# EAGLE design CPB_IEEE_out (EAGLE 9.6.2)
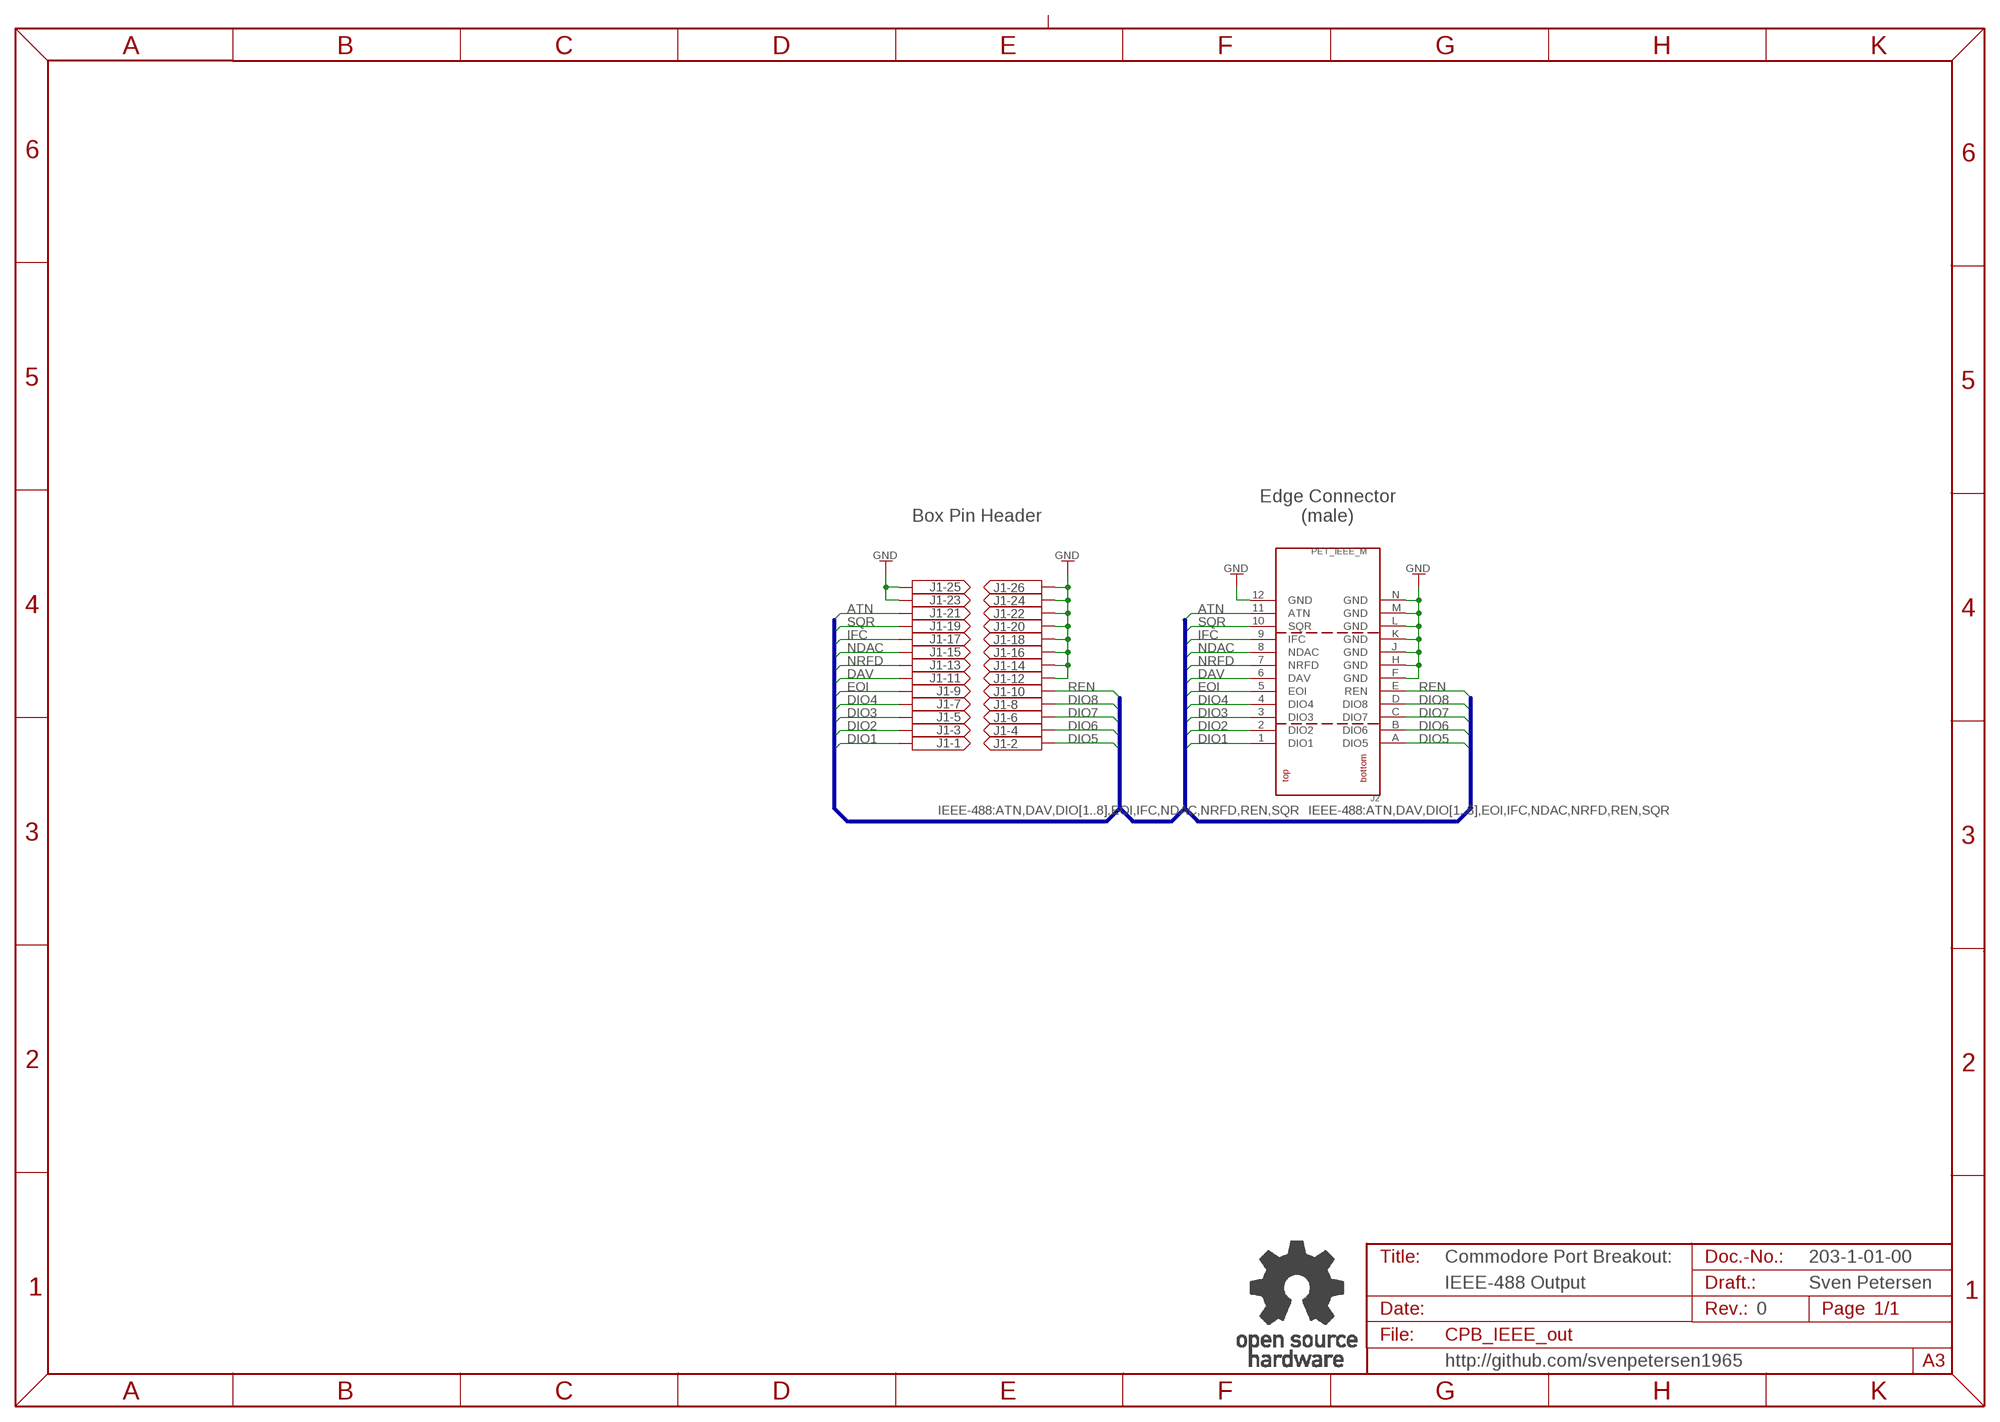
[diagram p0: schematic, sheet 1]

## Parts
J1  2X13WANNE  [2X13WV]
J2  PET_IEEE_M  [PET_IEEE_M]
U$9  OPEN_SOURCE_HW  [OPENHW]

## Nets
ATN: J1.21 J2.11(ATN)
DAV: J1.11 J2.6(DAV)
DIO1: J1.1 J2.1(DIO1)
DIO2: J1.3 J2.2(DIO2)
DIO3: J1.5 J2.3(DIO3)
DIO4: J1.7 J2.4(DIO4)
DIO5: J1.2 J2.A(DIO5)
DIO6: J1.4 J2.B(DIO6)
DIO7: J1.6 J2.C(DIO7)
DIO8: J1.8 J2.D(DIO8)
EOI: J1.9 J2.5(EOI)
GND: J1.12 J1.14 J1.16 J1.18 J1.20 J1.22 J1.23 J1.24 J1.25 J1.26 J2.12(GND) J2.F(GND) J2.H(GND) J2.J(GND) J2.K(GND) J2.L(GND) J2.M(GND) J2.N(GND)
IFC: J1.17 J2.9(IFC)
NDAC: J1.15 J2.8(NDAC)
NRFD: J1.13 J2.7(NRFD)
REN: J1.10 J2.E(REN)
SQR: J1.19 J2.10(SQR)

## Buses
IEEE-488:ATN,DAV,DIO[1..8],EOI,IFC,NDAC,NRFD,REN,SQR

## Notes on the sheet
- Box Pin Header
- Edge Connector
  (male)
- Commodore Port Breakout: | 203-1-01-00
- IEEE-488 Output | Sven Petersen
- 0
- http://github.com/svenpetersen1965

## Library data of the parts
J1 = PINHEAD:2X13WANNE
J2 = Commodore:PET_IEEE
U$9 = Logo:OPEN_SOURCE_HW

## Board
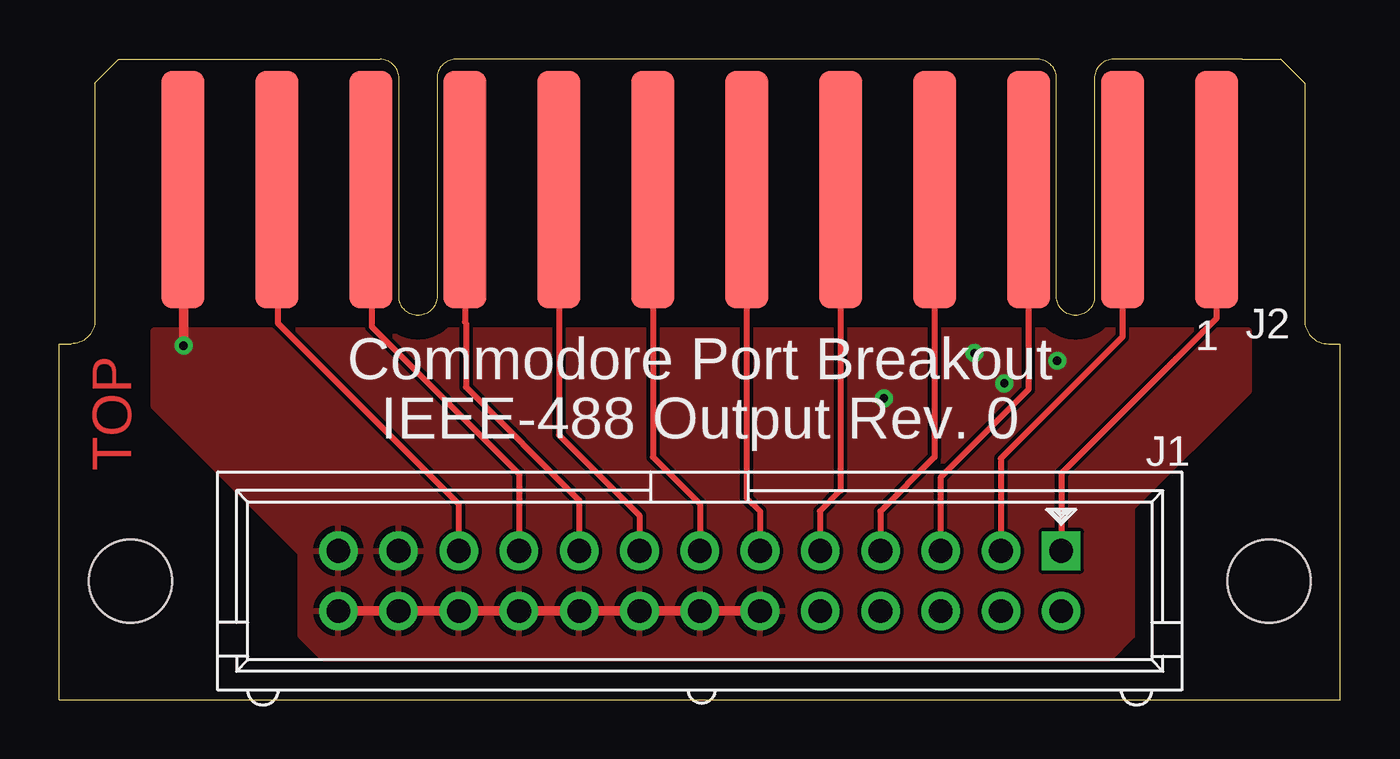
[diagram p1: board, top side]
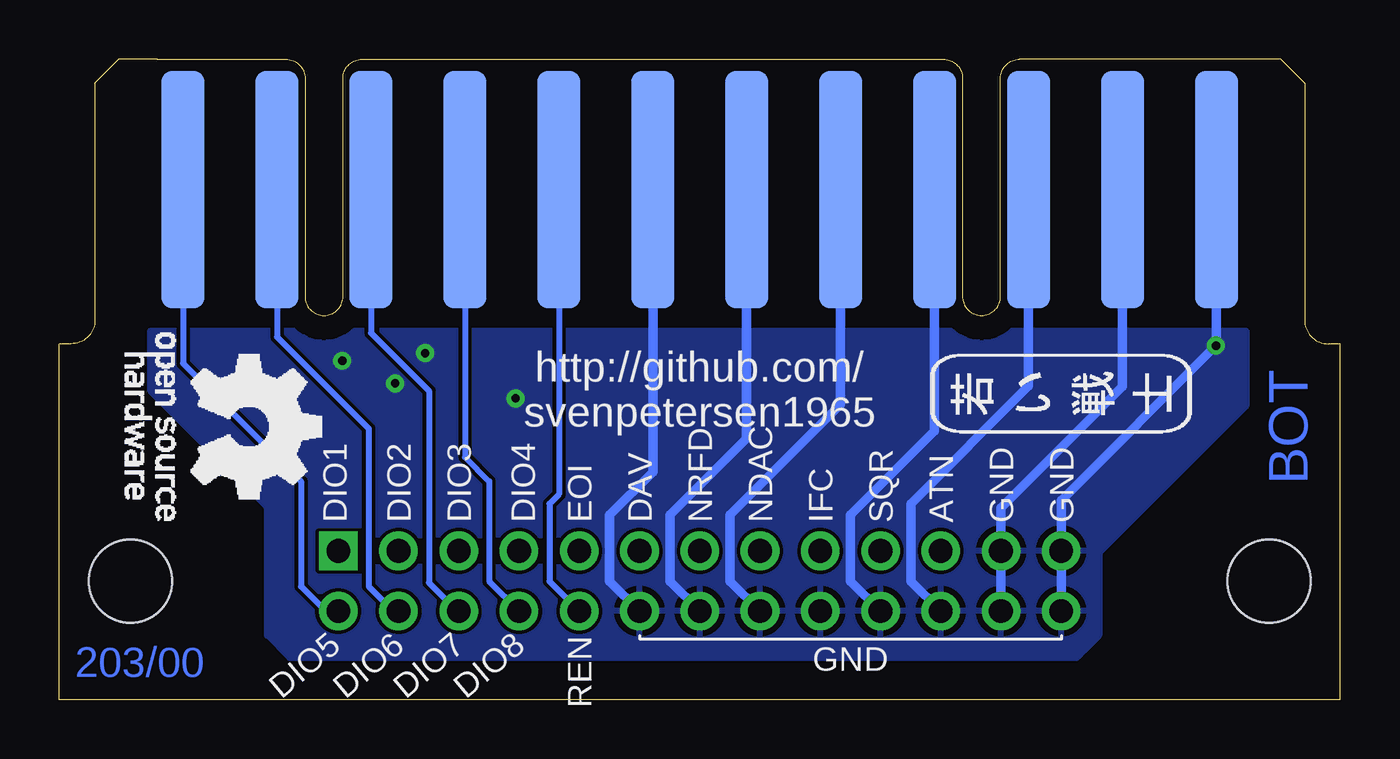
[diagram p2: board, bottom side, seen from below]

Size 54 x 27 mm. Coordinates in mm from the lower left corner, seen from the top.
Outline: 0.5,15 0,15 0,0 54,0 54,15 53.5,15
Copper layers (1*16): Top 0.035mm / dielectric 1.5mm / Bottom 0.035mm
Design rules "default *": minimum track width 6mil, minimum drill 0.35mm, track to track 6mil, track to pad 6mil, pad to pad 6mil, via to via 6mil, smd to smd 6mil, copper to edge 40mil, drill to drill 6mil, minimum pad ring 10mil, minimum via ring 8mil, stop-mask expansion 4mil, vias tented up to drill 25mil, thermal gap 10mil
Holes 3.5 mm at 3,5 51,5
bRestrict: 3 lines

### Footprints (pad centres in the part's own frame; a part is rotated, then mirrored left to right if it is on the bottom)
2X13WV = drill 1 pad 1.626 square: 1 -15.24,-1.27 | drill 1 pad 1.626: 2 -15.24,1.27; 3 -12.7,-1.27; 4 -12.7,1.27; 5 -10.16,-1.27; 6 -10.16,1.27; 7 -7.62,-1.27; 8 -7.62,1.27; 9 -5.08,-1.27; 10 -5.08,1.27; 11 -2.54,-1.27; 12 -2.54,1.27; 13 0,-1.27; 14 0,1.27; 15 2.54,-1.27; 16 2.54,1.27; 17 5.08,-1.27; 18 5.08,1.27; 19 7.62,-1.27; 20 7.62,1.27; 21 10.16,-1.27; 22 10.16,1.27; 23 12.7,-1.27; 24 12.7,1.27; 25 15.24,-1.27; 26 15.24,1.27
PET_IEEE_M = smd 1.8 x 10: 1 -21.78,5.5; 2 -17.82,5.5; 3 -13.86,5.5; 4 -9.9,5.5; 5 -5.94,5.5; 6 -1.98,5.5; 7 1.98,5.5; 8 5.94,5.5; 9 9.9,5.5; 10 13.86,5.5; 11 17.82,5.5; 12 21.78,5.5 | smd 1.8 x 10 bottom: A -21.78,5.5; B -17.82,5.5; C -13.86,5.5; D -9.9,5.5; E -5.94,5.5; F -1.98,5.5; H 1.98,5.5; J 5.94,5.5; K 9.9,5.5; L 13.86,5.5; M 17.82,5.5; N 21.78,5.5

### Placement (x,y rotation side)
J1  27,5 180 top
J2  27,27 180 top
U$8  [PCB-TITLE/]  0,36.82 0 top  (outside the outline)
U$9  51.22,15.45 270 bottom
U$10  [2LAYER]  3.04,9.64 90 top
U$11  [SVEN_TAG]  11.88,12.94 90 bottom

### Tracks (layer width: path | path; a pad name or v marks a point on that pad's centre or on a via)
ATN
  Top 0.254: J2.11 9.21,21.47 9.21,15.88 16.84,8.24 J1.21
DAV
  Top 0.254: J2.6 28.98,8.48 29.54,7.92 J1.11
DIO1
  Top 0.254: J2.1 48.78,16.08 42.24,9.54 J1.1
DIO2
  Top 0.254: J2.2 44.82,15.29 39.69,10.16 39.69,6.28 J1.3
DIO3
  Top 0.254: J2.3 40.86,13.08 37.15,9.37 37.15,6.28 J1.5
DIO4
  Top 0.254: J2.4 36.9,10.23 34.61,7.94 34.61,6.28 J1.7
DIO5
  Bottom 0.254: J2.A 48.78,14.17 43.81,9.21 43.81,4.76 42.78,3.73 J1.2
DIO6
  Bottom 0.254: J2.B 44.82,15.29 40.96,11.43 40.96,4.76 39.92,3.73 J1.4
DIO7
  Bottom 0.254: J2.C 40.86,15.46 38.42,13.02 38.42,4.92 37.23,3.73 J1.6
DIO8
  Bottom 0.254: J2.D 36.9,10.23 35.88,9.21 35.88,4.99 J1.8
EOI
  Top 0.254: J2.5 32.94,8.81 32.07,7.94 32.07,6.28 J1.9
GND  (via drill 0.35)
  Top 0.406: J2.N 5.24,21.48 v5.24,14.92 | J1.26 J1.24 J1.22 J1.20 J1.18 J1.16 J1.14 J1.12
  Bottom 0.406: J2.F 28.98,9.6 30.8,7.78 30.8,4.99 J1.12 | J2.H 25.02,11.02 28.26,7.78 28.26,4.99 J1.14 | J2.J 21.06,12.44 25.72,7.78 25.72,4.99 J1.16 | J2.K 17.1,11.32 20.64,7.78 20.64,4.99 J1.20 | J2.L 13.14,13.21 18.1,8.26 18.1,4.99 J1.22 | J2.M 9.18,13.2 14.3,8.08 J1.23 J1.24 | J2.N 5.22,14.94 v5.24,14.92 11.76,8.4 J1.25 J1.26
  other vias: 34.77,12.7 42.07,14.29 39.85,13.34 38.58,14.61
  pour Top: 3.97,15.56 3.97,12.38 10.16,6.19 10.16,2.7 11.11,1.75 44.29,1.75 45.24,2.7 45.24,8.1 50.16,13.02 50.16,15.56
  pour Bottom: 3.97,15.56 3.97,12.38 10.16,6.19 10.16,2.7 11.11,1.75 44.29,1.75 45.24,2.7 45.24,8.1 50.16,13.02 50.16,15.56
IFC
  Top 0.254: J2.9 17.1,15.92 17.14,15.88 17.14,13.18 21.92,8.4 J1.17
NDAC
  Top 0.254: J2.8 21.06,11.17 24.46,7.77 J1.15
NRFD
  Top 0.254: J2.7 25.02,10.22 27,8.24 J1.13
REN
  Bottom 0.254: J2.E 32.94,8.65 33.34,8.26 33.34,4.99 J1.10
SQR
  Top 0.254: J2.10 13.18,21.46 13.18,15.73 19.38,9.52 J1.19

### Text on the board
Bottom: 203/00
tPlace: Commodore Port Breakout | IEEE-488 Output Rev. 0
bPlace: http://github.com/ / svenpetersen1965 | GND | GND | ATN | SQR | IFC | NDAC | NRFD | DAV | EOI | DIO4 | DIO3 | DIO2 | DIO1 | REN | DIO8 | DIO7 | DIO6 | DIO5 | GND
Document: 203-2-01-00 | Sven Petersen / 2022 | 35µm | 2 | 0